# Altium schematic sheet HyperRAM.SchDoc: Pulp FMC Sensor Board
size A4; Author: A. Blanco Fontao; CompanyName: ETHZ; DrawnBy: A. Blanco Fontao; Organization: Microelectronics Design Center; Address1: Gloriastrasse 35; Address2: 8092 Zurich; Address3: Switzerland; SheetNumber: 4; SheetTotal: 7
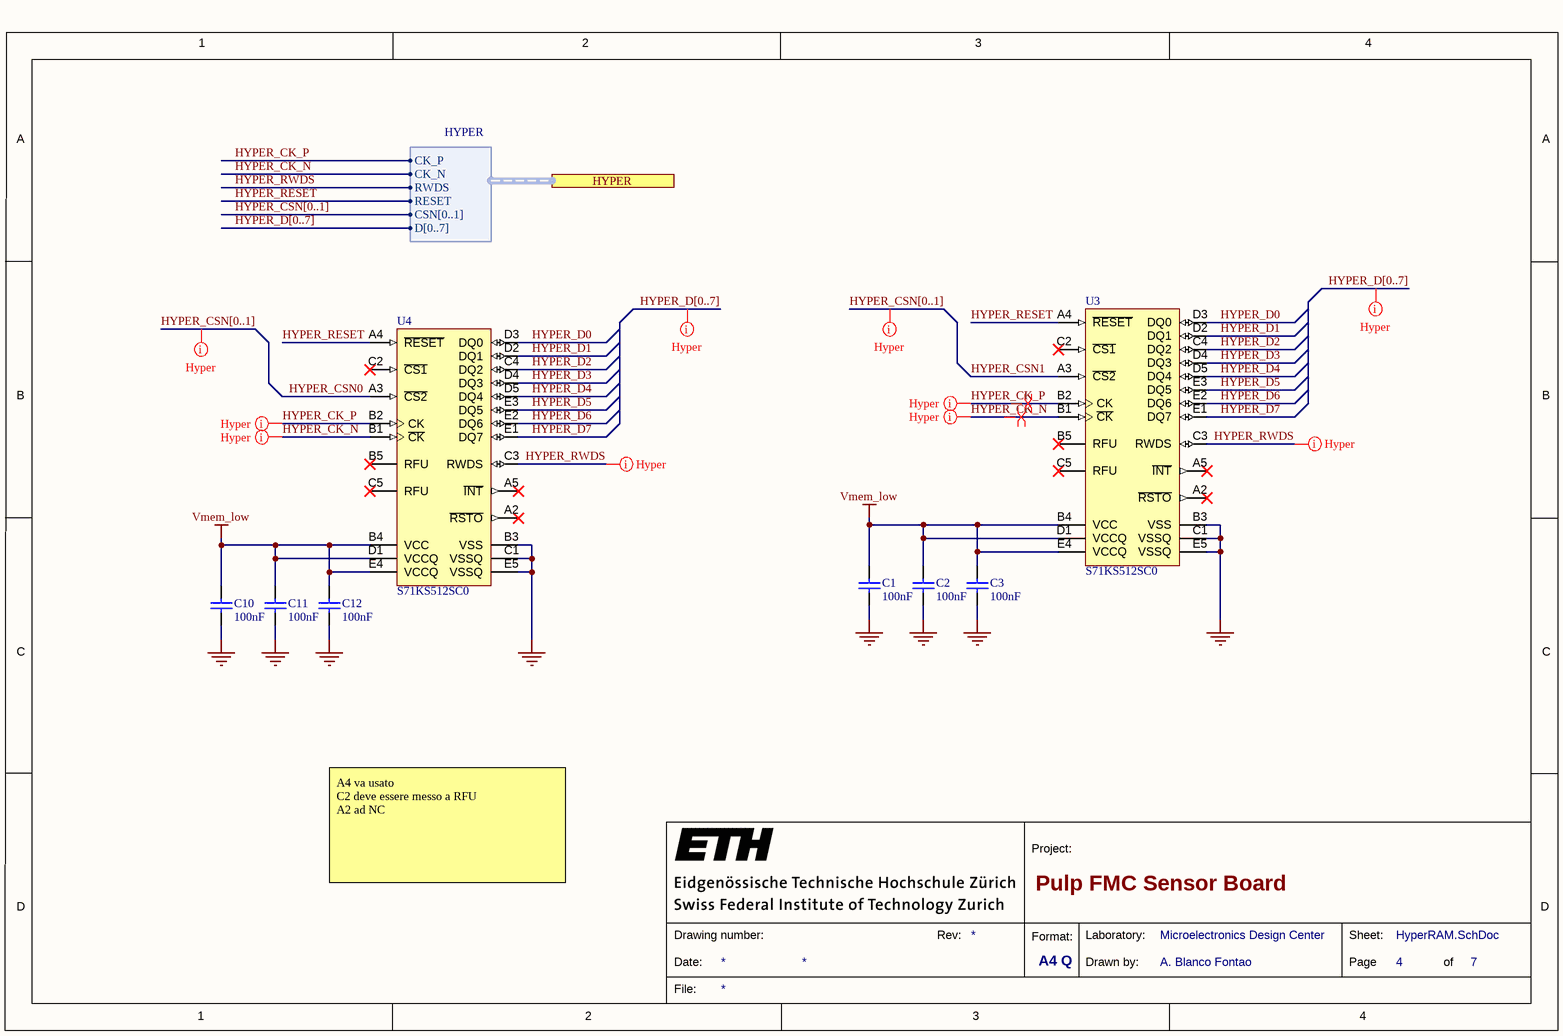
[diagram p0: HyperRAM.SchDoc]

## Parts
C1  value 100nF  [CAPC0603(1608)100_N]  (hidden comment: CAP 100nF 25V 0603(1608))
C2  value 100nF  [CAPC0603(1608)100_N]  (hidden comment: CAP 100nF 25V 0603(1608))
C3  value 100nF  [CAPC0603(1608)100_N]  (hidden comment: CAP 100nF 25V 0603(1608))
C10  value 100nF  [CAPC0603(1608)100_N]  (hidden comment: CAP 100nF 25V 0603(1608))
C11  value 100nF  [CAPC0603(1608)100_N]  (hidden comment: CAP 100nF 25V 0603(1608))
C12  value 100nF  [CAPC0603(1608)100_N]  (hidden comment: CAP 100nF 25V 0603(1608))
U3  S71KS512SC0  [FBGA24_A-130]
U4  S71KS512SC0  [FBGA24_A-130]

## Ports
HYPER (harness HYPER)

## Harnesses
HYPER: CK_N, CK_P, RWDS, CSN[0..1], D[0..7], RESET

## Nets
GND: C1.1 C2.1 C3.1 C10.1 C11.1 C12.1 U3.B3(VSS) U3.C1(VSSQ) U3.E5(VSSQ) U4.B3(VSS) U4.C1(VSSQ) U4.E5(VSSQ)
Vmem_low: C1.2 C2.2 C3.2 C10.2 C11.2 C12.2 U3.B4(VCC) U3.D1(VCCQ) U3.E4(VCCQ) U4.B4(VCC) U4.D1(VCCQ) U4.E4(VCCQ)
HYPER_CK_N: U3.B1(~{CK}) U4.B1(~{CK}) ; port HYPER.CK_N
HYPER_CK_P: U3.B2(CK) U4.B2(CK) ; port HYPER.CK_P
HYPER_CSN0: U4.A3(~{CS2})
HYPER_CSN1: U3.A3(~{CS2})
HYPER_D0: U3.D3(DQ0) U4.D3(DQ0)
HYPER_D1: U3.D2(DQ1) U4.D2(DQ1)
HYPER_D2: U3.C4(DQ2) U4.C4(DQ2)
HYPER_D3: U3.D4(DQ3) U4.D4(DQ3)
HYPER_D4: U3.D5(DQ4) U4.D5(DQ4)
HYPER_D5: U3.E3(DQ5) U4.E3(DQ5)
HYPER_D6: U3.E2(DQ6) U4.E2(DQ6)
HYPER_D7: U3.E1(DQ7) U4.E1(DQ7)
HYPER_RESET: U3.A4(~{RESET}) U4.A4(~{RESET}) ; port HYPER.RESET
HYPER_RWDS: U3.C3(RWDS) U4.C3(RWDS) ; port HYPER.RWDS

Not connected (* = marked no-connect by the designer): U3 A2(~{RSTO})* A5(~{INT})* B5(RFU)* C2(~{CS1})* C5(RFU)*; U4 A2(~{RSTO})* A5(~{INT})* B5(RFU)* C2(~{CS1})* C5(RFU)*

## Buses and harness runs
bus HYPER_CSN[0..1]
bus HYPER_D[0..7]

## Layout directives
net class Hyper: (no net found under the mark), HYPER_CK_N, HYPER_CK_P, HYPER_RWDS
differential pair: HYPER_CK_N, HYPER_CK_P

## Notes on the sheet
- A4 va usato
  C2 deve essere messo a RFU
  A2 ad NC
- 1
- 2
- 3
- 4
- A
- B
- C
- Project:
- D
- Date:
- Drawing number:
- Rev:
- Format:
- A4 Q
- Drawn by:
- Laboratory:
- Page
- Sheet:
- of
- File:

## Library data of the parts
C1-C3 C10-C12 = CMP-1035-02588-1: CAP 100nF 25V ±10% 0603 (1608 Metric) Thickness 1mm SMD; Case-Metric: 1608; Case-EIA: 0603; Tolerance: Â±10%; Max Thickness: 1 mm; Technology: SMT; Rated Voltage: 25 V
U3 U4 = CMP-00514-1: IC 512MB FLASH 64MB DRAM 24FBGA; Manufacturer: Cypress Semiconductor Corp; Memory Format: FLASH, RAM; Memory Type: Non-Volatile; Memory Size: 512Mbit Flash, 64Mbit RAM; Speed: 100MHz; Interface: Parallel, Serial; Voltage - Supply: 1.8V; Series: HyperFlash™ + HyperRAM™ KS; Package / Case: 24-VBGA; Supplier Device Package: 24-FBGA(6x8)